# Altium schematic sheet FPGA_Board.SchDoc
size A0
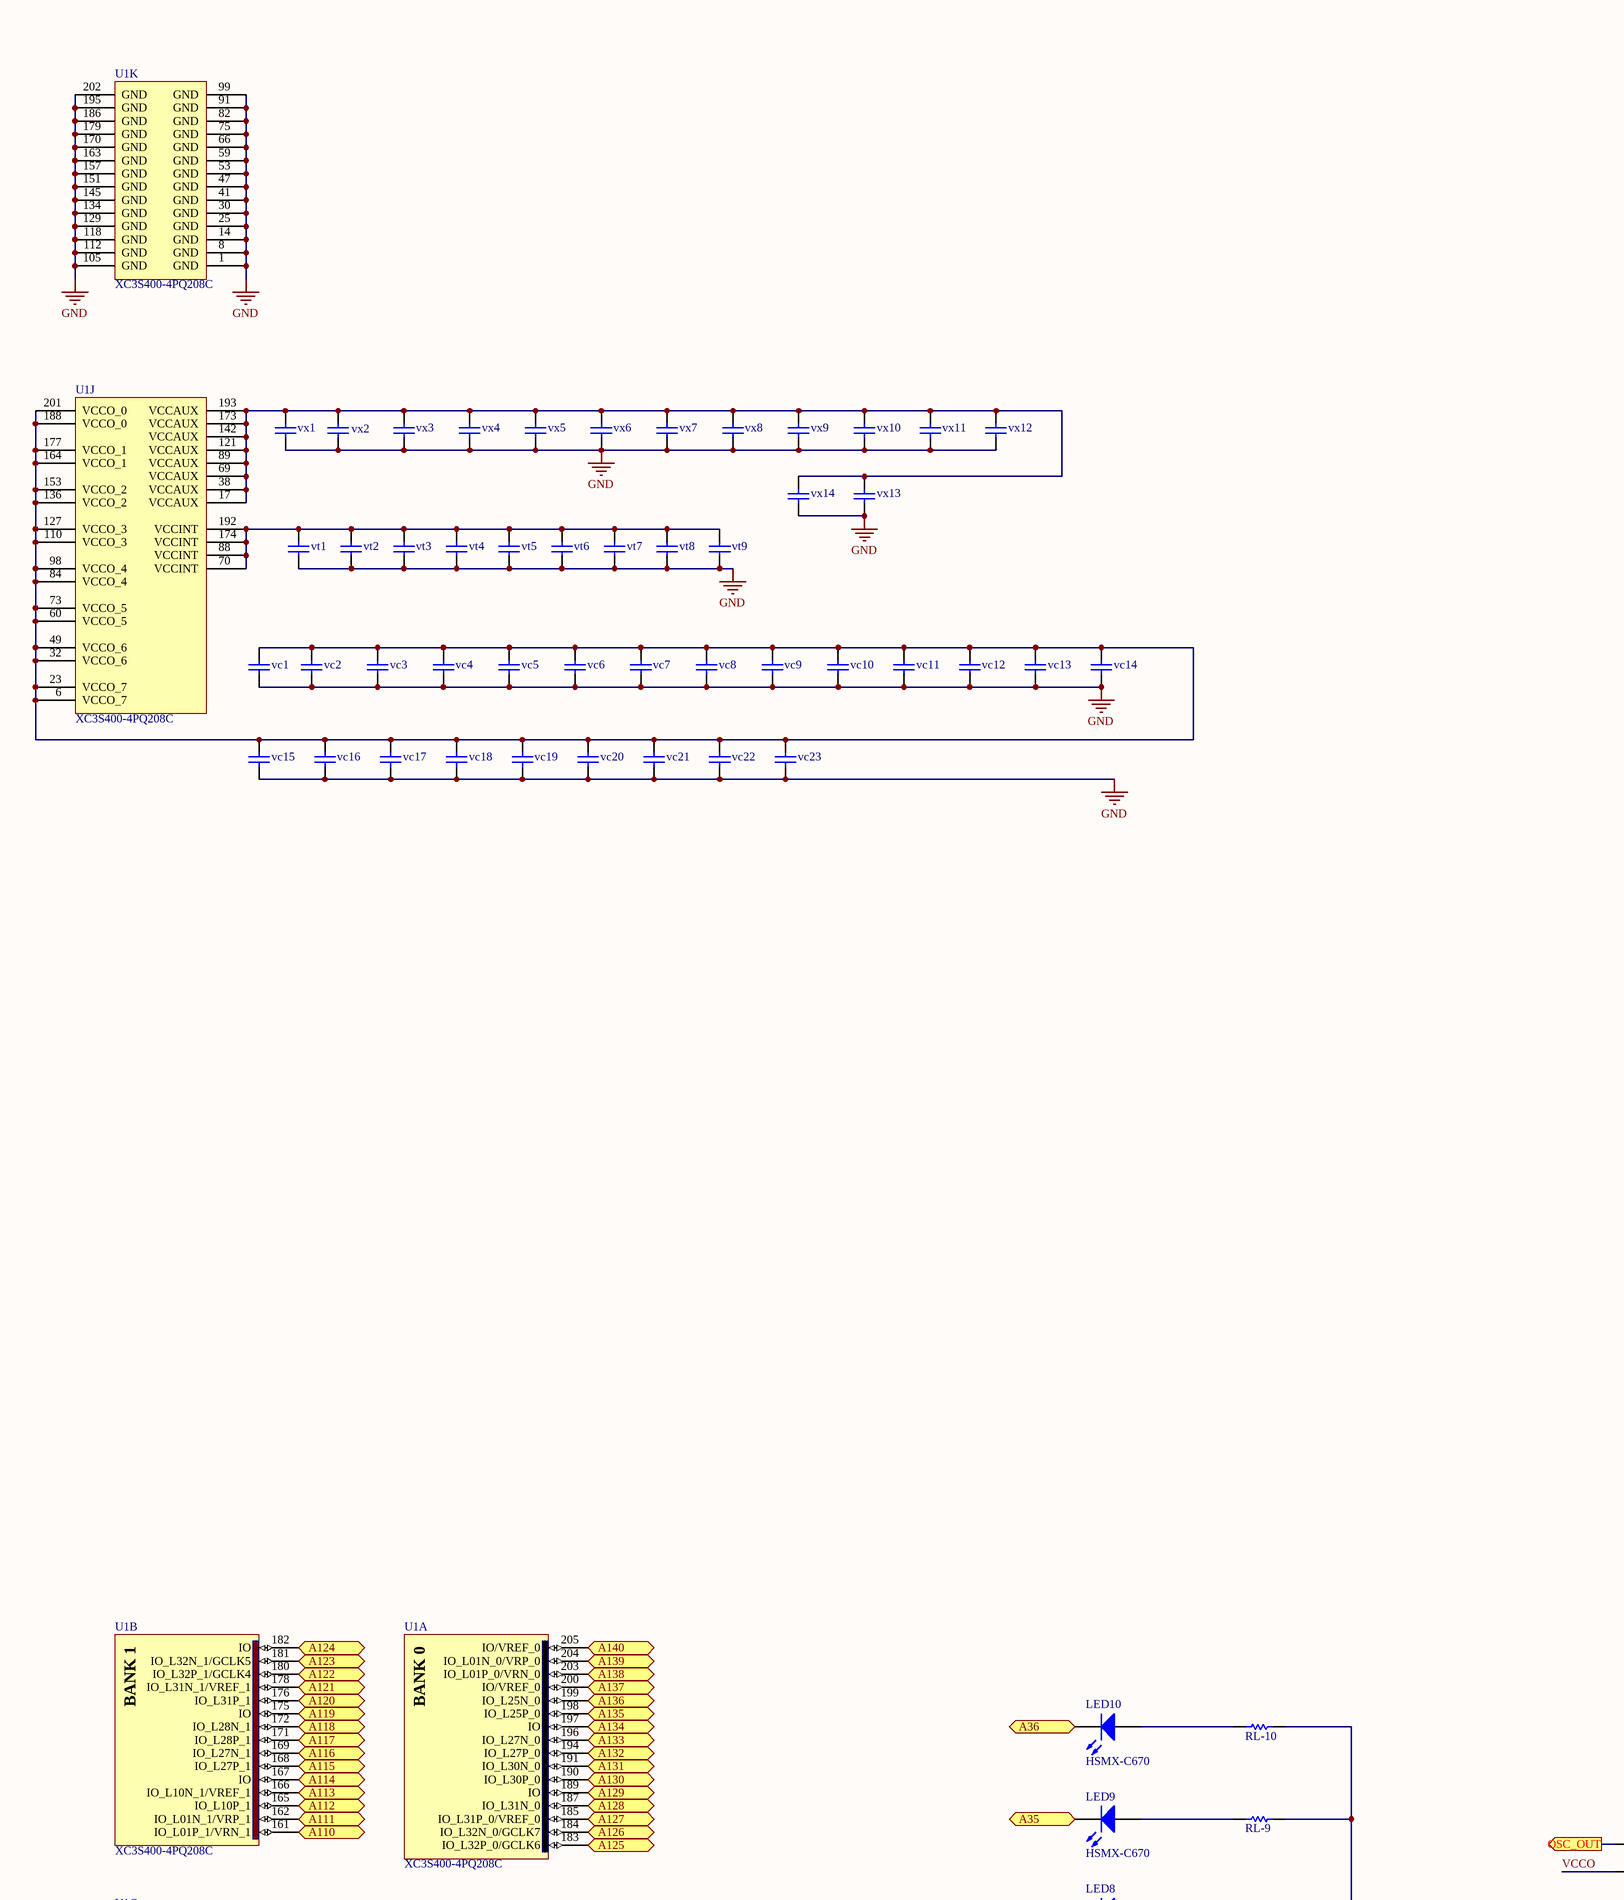
[diagram p0: FPGA_Board.SchDoc, top left]
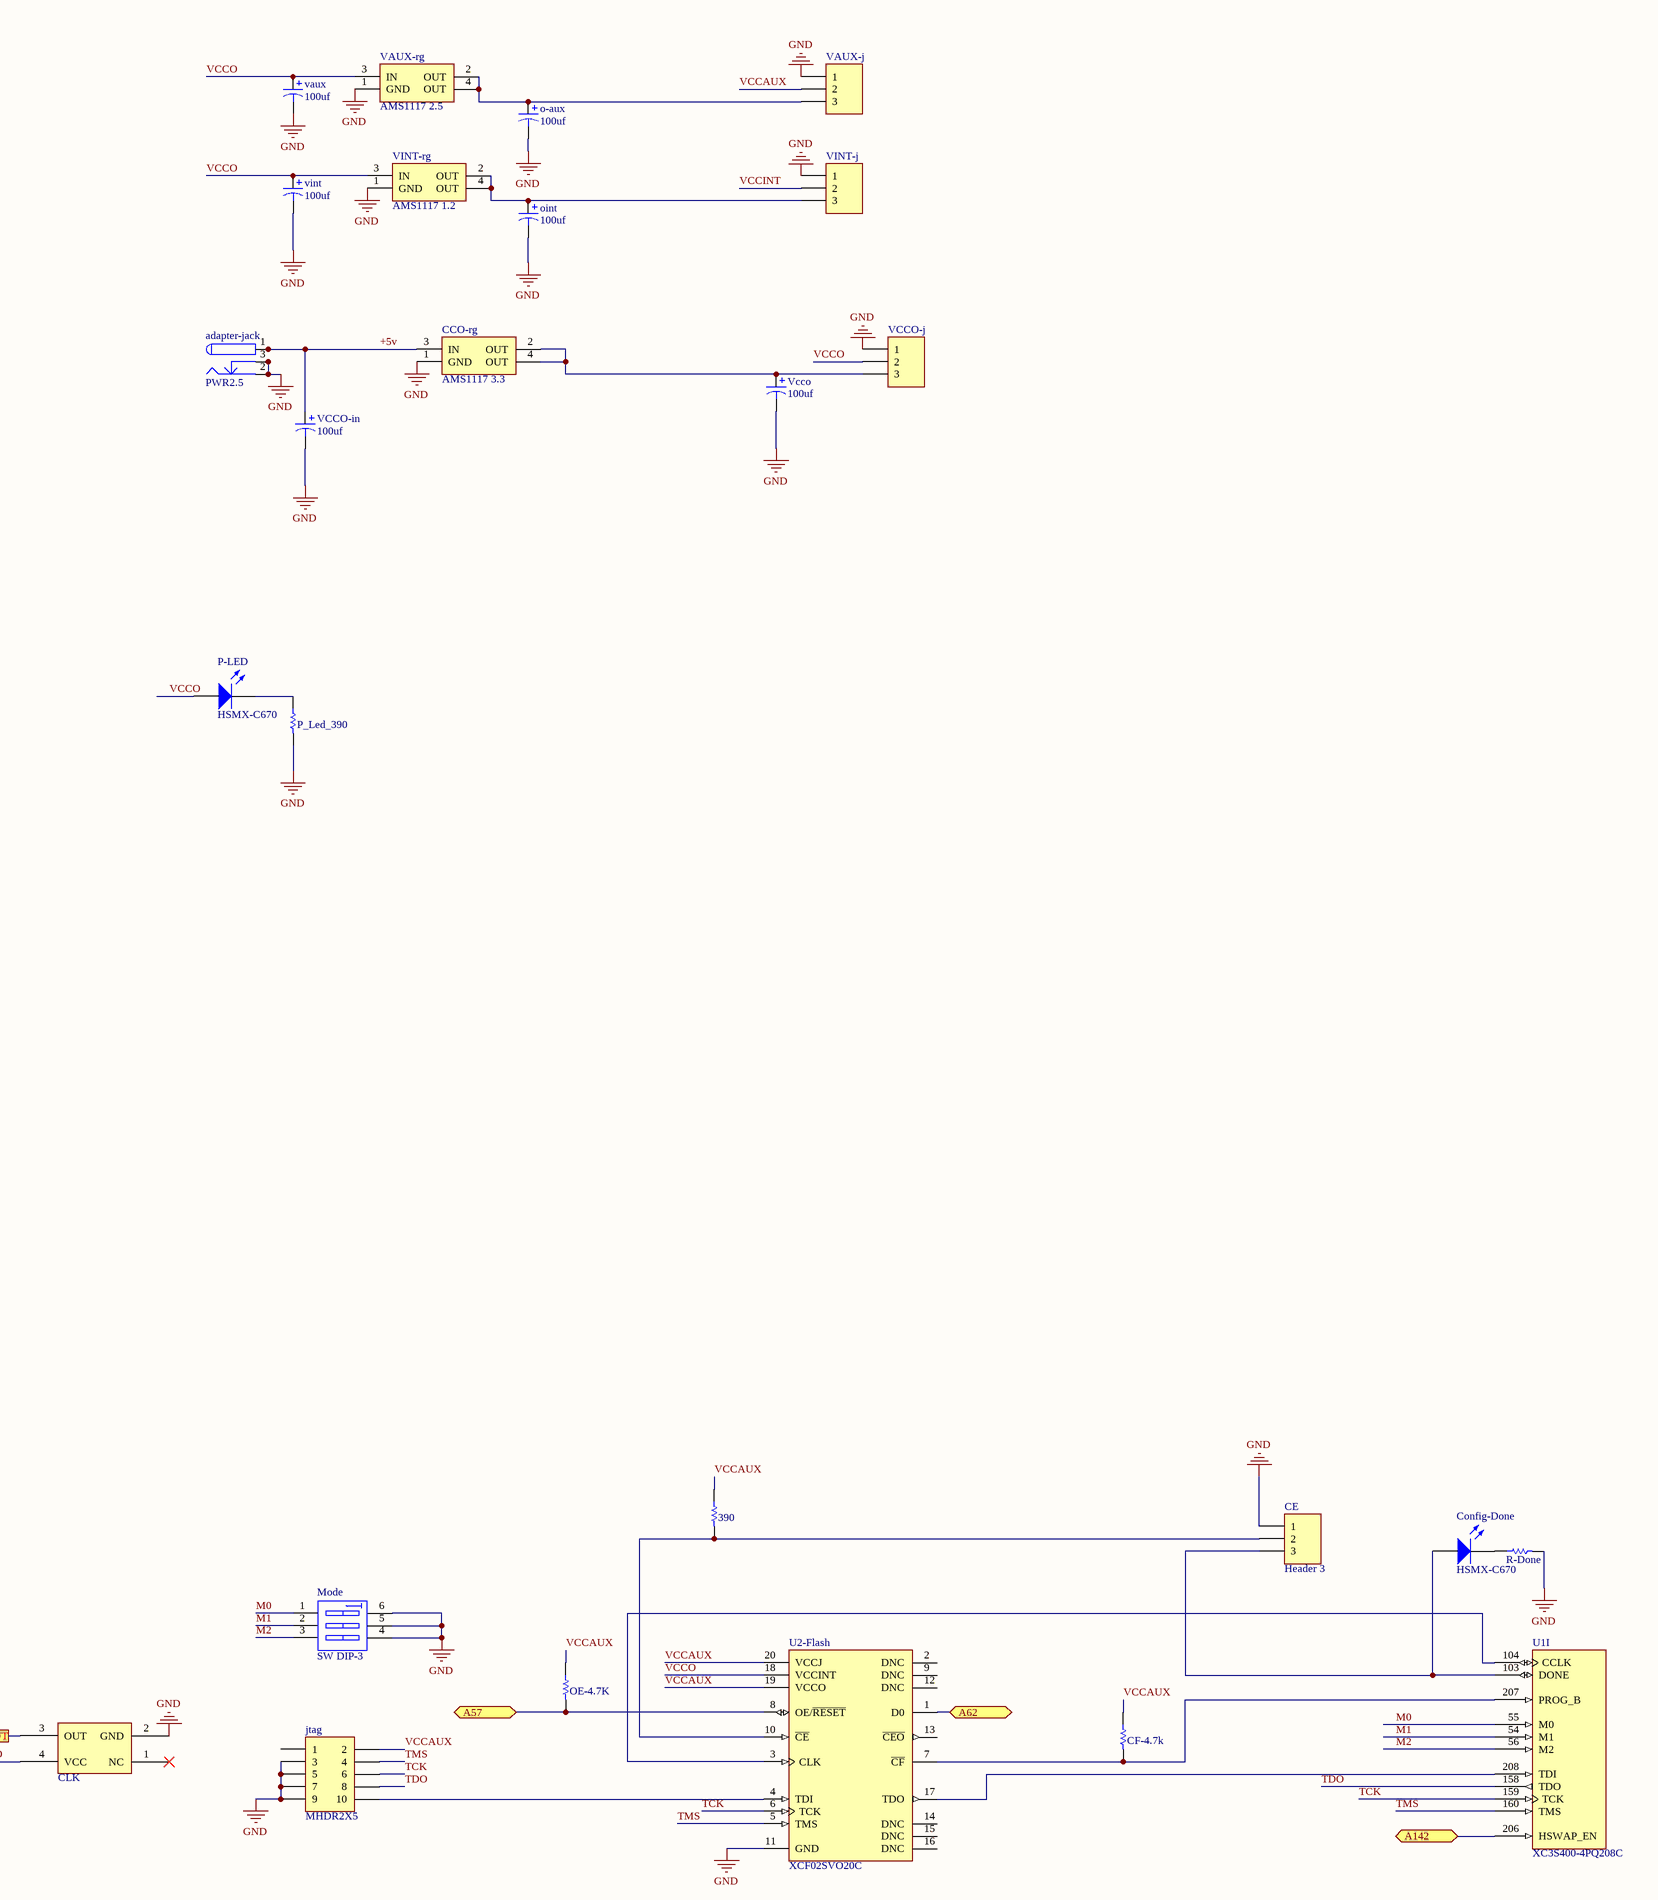
[diagram p1: FPGA_Board.SchDoc, top right]
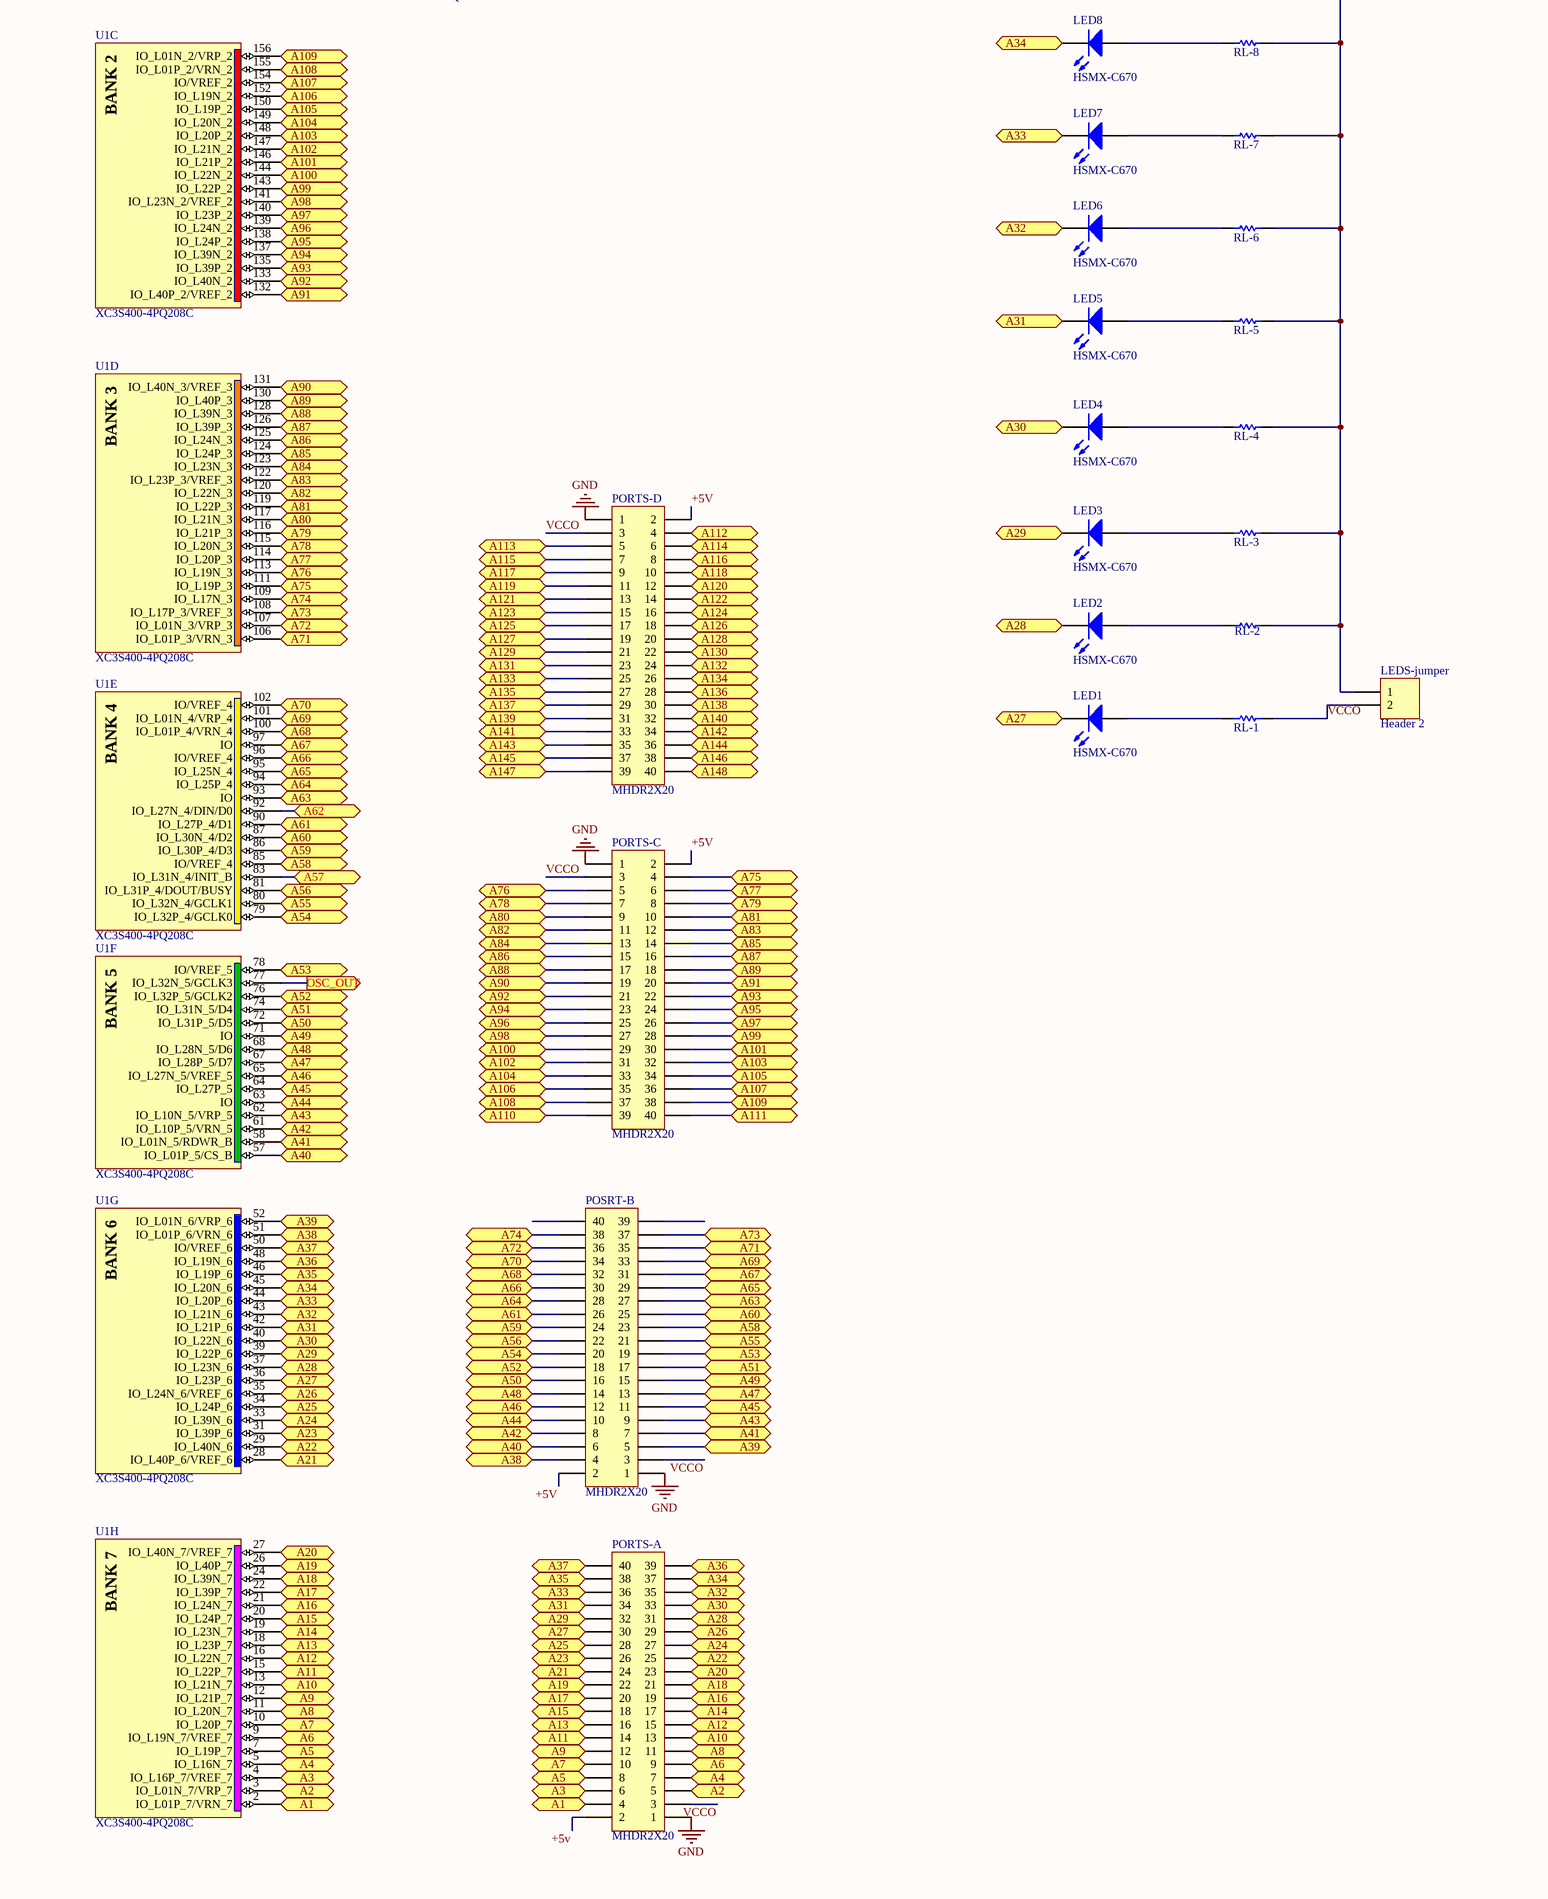
[diagram p2: FPGA_Board.SchDoc, bottom left]
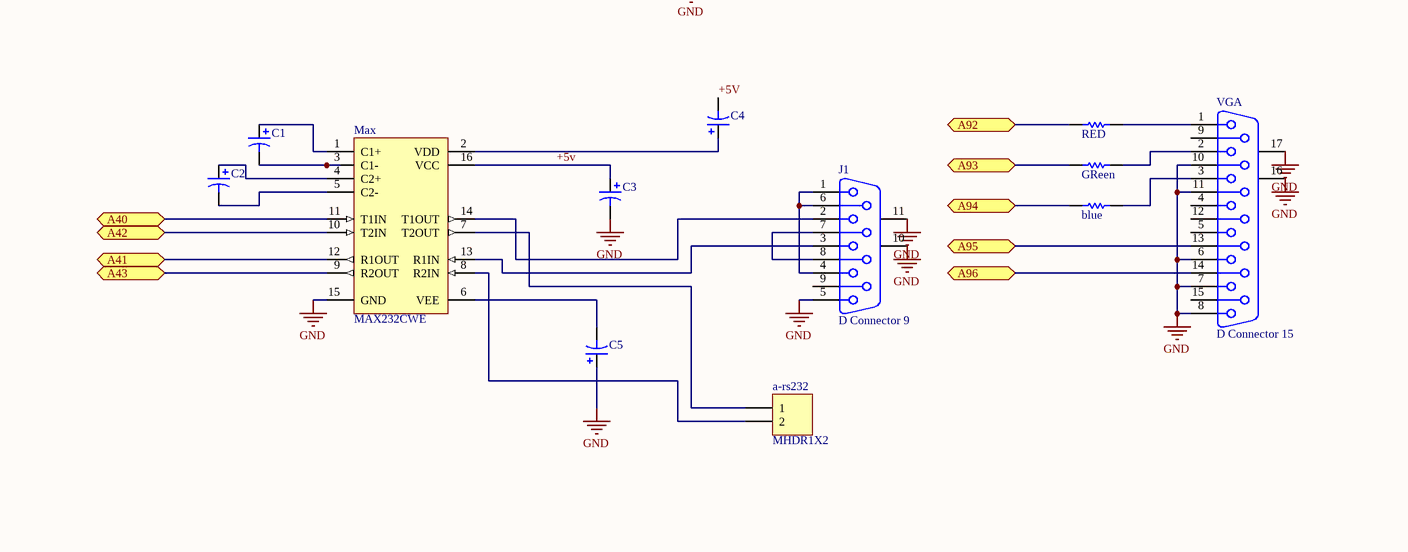
[diagram p3: FPGA_Board.SchDoc, bottom right]

## Parts
390  RES  [8-1206]  (value not drawn)
a-rs232  MHDR1X2  [HDR1X2]
adapter-jack  PWR2.5  [KLD-0202]
blue  RES  [8RB-1206]  (value not drawn)
C1  94SH105X0025ABP  [A']  (value not drawn)
C2  94SH105X0025ABP  [A']  (value not drawn)
C3  94SH105X0025ABP  [A']  (value not drawn)
C4  94SH105X0025ABP  [A']  (value not drawn)
C5  94SH105X0025ABP  [A']  (value not drawn)
CCO-rg  AMS1117 3.3  [MP04A_L]
CE  Header 3  [HDR1X3]
CF-4.7k  RES  [8-1206]  (value not drawn)
CLK  50MHZ  [50mhz]  (value not drawn)
Config-Done  HSMX-C670  [1206]
GReen  RES  [8RB-1206]  (value not drawn)
J1  D Connector 9  [DSUB1.385-2H9]
jtag  MHDR2X5  [HDR2X5]
LED1  HSMX-C670  [1206]
LED2  HSMX-C670  [1206]
LED3  HSMX-C670  [1206]
LED4  HSMX-C670  [1206]
LED5  HSMX-C670  [1206]
LED6  HSMX-C670  [1206]
LED7  HSMX-C670  [1206]
LED8  HSMX-C670  [1206]
LED9  HSMX-C670  [1206]
LED10  HSMX-C670  [1206]
LEDS-jumper  Header 2  [HDR1X2]
Max  MAX232CWE  [WSO16_N]
Mode  SW DIP-3  [DIP-6]
o-aux  100uf  [B]
OE-4.7K  RES  [8-1206]  (value not drawn)
oint  100uf  [B]
P-LED  HSMX-C670  [1206]
P_Led_390  RES  [8-1206]  (value not drawn)
PORTS-A  MHDR2X20  [HDR2X20]
PORTS-C  MHDR2X20  [HDR2X20]
PORTS-D  MHDR2X20  [HDR2X20]
POSRT-B  MHDR2X20  [HDR2X20]
R-Done  RES  [8RB-1206]  (value not drawn)
RED  RES  [8RB-1206]  (value not drawn)
RL-1  RES  [1206]  (value not drawn)
RL-2  RES  [1206]  (value not drawn)
RL-3  RES  [1206]  (value not drawn)
RL-4  RES  [1206]  (value not drawn)
RL-5  RES  [1206]  (value not drawn)
RL-6  RES  [1206]  (value not drawn)
RL-7  RES  [1206]  (value not drawn)
RL-8  RES  [1206]  (value not drawn)
RL-9  RES  [1206]  (value not drawn)
RL-10  RES  [1206]  (value not drawn)
U1  XC3S400-4PQ208C  [PQ208_N]  (parts A,B,C,D,E,F,G,H,I,J,K of 11)
U2-Flash  XCF02SVO20C  [VO20_N]
vaux  100uf  [B]
VAUX-j  (no value)  [HDR1X3]
VAUX-rg  AMS1117 2.5  [SOT223_L]
vc1  (no value)  [1206]
vc2  (no value)  [1206]
vc3  (no value)  [1206]
vc4  (no value)  [1206]
vc5  (no value)  [1206]
vc6  (no value)  [1206]
vc7  (no value)  [1206]
vc8  (no value)  [1206]
vc9  (no value)  [1206]
vc10  (no value)  [1206]
vc11  (no value)  [1206]
vc12  (no value)  [1206]
vc13  (no value)  [1206]
vc14  (no value)  [1206]
vc15  (no value)  [1206]
vc16  (no value)  [1206]
vc17  (no value)  [1206]
vc18  (no value)  [1206]
vc19  (no value)  [1206]
vc20  (no value)  [1206]
vc21  (no value)  [1206]
vc22  (no value)  [1206]
vc23  (no value)  [1206]
Vcco  100uf  [B]
VCCO-in  100uf  [B]
VCCO-j  (no value)  [HDR1X3]
VGA  D Connector 15  [DSUB1.385-2H15]
vint  100uf  [B]
VINT-j  (no value)  [HDR1X3]
VINT-rg  AMS1117 1.2  [MP04A_L]
vt1  (no value)  [1206]
vt2  (no value)  [1206]
vt3  (no value)  [1206]
vt4  (no value)  [1206]
vt5  (no value)  [1206]
vt6  (no value)  [1206]
vt7  (no value)  [1206]
vt8  (no value)  [1206]
vt9  (no value)  [1206]
vx1  (no value)  [1206]
vx2  (no value)  [1206]
vx3  (no value)  [1206]
vx4  (no value)  [1206]
vx5  (no value)  [1206]
vx6  (no value)  [1206]
vx7  (no value)  [1206]
vx8  (no value)  [1206]
vx9  (no value)  [1206]
vx10  (no value)  [1206]
vx11  (no value)  [1206]
vx12  (no value)  [1206]
vx13  (no value)  [1206]
vx14  (no value)  [1206]

## Ports
A1 (out), A2 (out), A3 (out), A4 (out), A5 (out), A6 (out), A7 (out), A8 (out), A9 (out), A10 (out), A11 (out), A12 (out), A13 (out), A14 (out), A15 (out), A16 (out), A17 (out), A18 (out), A19 (out), A20 (out), A21 (out), A22 (out), A23 (out), A24 (out), A25 (out), A26 (out), A27, A27 (out), A28, A28 (out), A29, A29 (out), A30, A30 (out), A31, A31 (out), A32, A32 (out), A33, A33 (out), A34, A34 (out), A35, A35 (out), A36, A36 (out), A37 (out), A38, A38 (out), A39, A39 (out), A40, A41, A42, A43, A44, A45, A46, A47, A48, A49, A50, A51, A52, A53, A54, A55, A56, A57, A58, A59, A60, A61, A62, A63, A64, A65, A66, A67, A68, A69, A70, A71, A72, A73, A74, A75, A76, A77, A78, A79, A80, A81, A82, A83, A84, A85, A86, A87, A88, A89, A90, A91, A92, A93, A94, A95, A96, A97, A98, A99, A100, A101, A102, A103, A104, A105, A106, A107, A108, A109, A110, A111, A112, A113, A114, A115, A116, A117, A118, A119, A120, A121, A122, A123, A124, A125, A126, A127, A128, A129, A130, A131, A132, A133, A134, A135, A136, A137, A138, A139, A140, A141, A142, A143, A144, A145, A146, A147, A148, OSC_OUT (out)

## Nets
GND: adapter-jack.2 adapter-jack.2A adapter-jack.2B adapter-jack.3 adapter-jack.3A adapter-jack.3B C3.2 C5.1 CCO-rg.1(GND) CE.1 CLK.2(GND) J1.5 J1.10(MH1) J1.11(MH2) jtag.3 jtag.5 jtag.7 jtag.9 Max.15(GND) Mode.4(B3) Mode.5(B2) Mode.6(B1) o-aux.2 oint.2 P_Led_390.2 PORTS-A.1 PORTS-C.1 PORTS-D.1 POSRT-B.1 R-Done.2 U1.1(GND) U1.8(GND) U1.14(GND) U1.25(GND) U1.30(GND) U1.41(GND) U1.47(GND) U1.53(GND) U1.59(GND) U1.66(GND) U1.75(GND) U1.82(GND) U1.91(GND) U1.99(GND) U1.105(GND) U1.112(GND) U1.118(GND) U1.129(GND) U1.134(GND) U1.145(GND) U1.151(GND) U1.157(GND) U1.163(GND) U1.170(GND) U1.179(GND) U1.186(GND) U1.195(GND) U1.202(GND) U2-Flash.11(GND) vaux.2 VAUX-j.1 VAUX-rg.1(GND) vc1.2 vc2.2 vc3.2 vc4.2 vc5.2 vc6.2 vc7.2 vc8.2 vc9.2 vc10.2 vc11.2 vc12.2 vc13.2 vc14.2 vc15.2 vc16.2 vc17.2 vc18.2 vc19.2 vc20.2 vc21.2 vc22.2 vc23.2 Vcco.2 VCCO-in.2 VCCO-j.1 VGA.6 VGA.7 VGA.8 VGA.10 VGA.11 VGA.16(MH1) VGA.17(MH2) vint.2 VINT-j.1 VINT-rg.1(GND) vt1.1 vt2.1 vt3.1 vt4.1 vt5.1 vt6.1 vt7.1 vt8.1 vt9.1 vx1.1 vx2.1 vx3.1 vx4.1 vx5.1 vx6.1 vx7.1 vx8.1 vx9.1 vx10.1 vx11.1 vx12.1 vx13.1 vx14.1
+5v: adapter-jack.1 adapter-jack.1A adapter-jack.1B C3.1 C4.2 CCO-rg.3(IN) Max.16(VCC) PORTS-A.2 PORTS-C.2 PORTS-D.2 POSRT-B.2 VCCO-in.1
A1: PORTS-A.4 U1.2(IO_L01P_7/VRN_7) ; port A1
A2: PORTS-A.5 U1.3(IO_L01N_7/VRP_7) ; port A2
A3: PORTS-A.6 U1.4(IO_L16P_7/VREF_7) ; port A3
A4: PORTS-A.7 U1.5(IO_L16N_7) ; port A4
A5: PORTS-A.8 U1.7(IO_L19P_7) ; port A5
A6: PORTS-A.9 U1.9(IO_L19N_7/VREF_7) ; port A6
A7: PORTS-A.10 U1.10(IO_L20P_7) ; port A7
A8: PORTS-A.11 U1.11(IO_L20N_7) ; port A8
A9: PORTS-A.12 U1.12(IO_L21P_7) ; port A9
A10: PORTS-A.13 U1.13(IO_L21N_7) ; port A10
A11: PORTS-A.14 U1.15(IO_L22P_7) ; port A11
A12: PORTS-A.15 U1.16(IO_L22N_7) ; port A12
A13: PORTS-A.16 U1.18(IO_L23P_7) ; port A13
A14: PORTS-A.17 U1.19(IO_L23N_7) ; port A14
A15: PORTS-A.18 U1.20(IO_L24P_7) ; port A15
A16: PORTS-A.19 U1.21(IO_L24N_7) ; port A16
A17: PORTS-A.20 U1.22(IO_L39P_7) ; port A17
A18: PORTS-A.21 U1.24(IO_L39N_7) ; port A18
A19: PORTS-A.22 U1.26(IO_L40P_7) ; port A19
A20: PORTS-A.23 U1.27(IO_L40N_7/VREF_7) ; port A20
A21: PORTS-A.24 U1.28(IO_L40P_6/VREF_6) ; port A21
A22: PORTS-A.25 U1.29(IO_L40N_6) ; port A22
A23: PORTS-A.26 U1.31(IO_L39P_6) ; port A23
A24: PORTS-A.27 U1.33(IO_L39N_6) ; port A24
A25: PORTS-A.28 U1.34(IO_L24P_6) ; port A25
A26: PORTS-A.29 U1.35(IO_L24N_6/VREF_6) ; port A26
A27: LED1.2(K) PORTS-A.30 U1.36(IO_L23P_6) ; port A27
A28: LED2.2(K) PORTS-A.31 U1.37(IO_L23N_6) ; port A28
A29: LED3.2(K) PORTS-A.32 U1.39(IO_L22P_6) ; port A29
A30: LED4.2(K) PORTS-A.33 U1.40(IO_L22N_6) ; port A30
A31: LED5.2(K) PORTS-A.34 U1.42(IO_L21P_6) ; port A31
A32: LED6.2(K) PORTS-A.35 U1.43(IO_L21N_6) ; port A32
A33: LED7.2(K) PORTS-A.36 U1.44(IO_L20P_6) ; port A33
A34: LED8.2(K) PORTS-A.37 U1.45(IO_L20N_6) ; port A34
A35: LED9.2(K) PORTS-A.38 U1.46(IO_L19P_6) ; port A35
A36: LED10.2(K) PORTS-A.39 U1.48(IO_L19N_6) ; port A36
A37: PORTS-A.40 U1.50(IO/VREF_6) ; port A37
A38: POSRT-B.4 U1.51(IO_L01P_6/VRN_6) ; port A38
A39: POSRT-B.5 U1.52(IO_L01N_6/VRP_6) ; port A39
A40: Max.11(T1IN) POSRT-B.6 U1.57(IO_L01P_5/CS_B) ; port A40
A41: Max.12(R1OUT) POSRT-B.7 U1.58(IO_L01N_5/RDWR_B) ; port A41
A42: Max.10(T2IN) POSRT-B.8 U1.61(IO_L10P_5/VRN_5) ; port A42
A43: Max.9(R2OUT) POSRT-B.9 U1.62(IO_L10N_5/VRP_5) ; port A43
A44: POSRT-B.10 U1.63(IO) ; port A44
A45: POSRT-B.11 U1.64(IO_L27P_5) ; port A45
A46: POSRT-B.12 U1.65(IO_L27N_5/VREF_5) ; port A46
A47: POSRT-B.13 U1.67(IO_L28P_5/D7) ; port A47
A48: POSRT-B.14 U1.68(IO_L28N_5/D6) ; port A48
A49: POSRT-B.15 U1.71(IO) ; port A49
A50: POSRT-B.16 U1.72(IO_L31P_5/D5) ; port A50
A51: POSRT-B.17 U1.74(IO_L31N_5/D4) ; port A51
A52: POSRT-B.18 U1.76(IO_L32P_5/GCLK2) ; port A52
A53: POSRT-B.19 U1.78(IO/VREF_5) ; port A53
A54: POSRT-B.20 U1.79(IO_L32P_4/GCLK0) ; port A54
A55: POSRT-B.21 U1.80(IO_L32N_4/GCLK1) ; port A55
A56: POSRT-B.22 U1.81(IO_L31P_4/DOUT/BUSY) ; port A56
A57: OE-4.7K.2 U1.83(IO_L31N_4/INIT_B) U2-Flash.8(OE/~{RESET}) ; port A57
A58: POSRT-B.23 U1.85(IO/VREF_4) ; port A58
A59: POSRT-B.24 U1.86(IO_L30P_4/D3) ; port A59
A60: POSRT-B.25 U1.87(IO_L30N_4/D2) ; port A60
A61: POSRT-B.26 U1.90(IO_L27P_4/D1) ; port A61
A62: U1.92(IO_L27N_4/DIN/D0) U2-Flash.1(D0) ; port A62
A63: POSRT-B.27 U1.93(IO) ; port A63
A64: POSRT-B.28 U1.94(IO_L25P_4) ; port A64
A65: POSRT-B.29 U1.95(IO_L25N_4) ; port A65
A66: POSRT-B.30 U1.96(IO/VREF_4) ; port A66
A67: POSRT-B.31 U1.97(IO) ; port A67
A68: POSRT-B.32 U1.100(IO_L01P_4/VRN_4) ; port A68
A69: POSRT-B.33 U1.101(IO_L01N_4/VRP_4) ; port A69
A70: POSRT-B.34 U1.102(IO/VREF_4) ; port A70
A71: POSRT-B.35 U1.106(IO_L01P_3/VRN_3) ; port A71
A72: POSRT-B.36 U1.107(IO_L01N_3/VRP_3) ; port A72
A73: POSRT-B.37 U1.108(IO_L17P_3/VREF_3) ; port A73
A74: POSRT-B.38 U1.109(IO_L17N_3) ; port A74
A75: PORTS-C.4 U1.111(IO_L19P_3) ; port A75
A76: PORTS-C.5 U1.113(IO_L19N_3) ; port A76
A77: PORTS-C.6 U1.114(IO_L20P_3) ; port A77
A78: PORTS-C.7 U1.115(IO_L20N_3) ; port A78
A79: PORTS-C.8 U1.116(IO_L21P_3) ; port A79
A80: PORTS-C.9 U1.117(IO_L21N_3) ; port A80
A81: PORTS-C.10 U1.119(IO_L22P_3) ; port A81
A82: PORTS-C.11 U1.120(IO_L22N_3) ; port A82
A83: PORTS-C.12 U1.122(IO_L23P_3/VREF_3) ; port A83
A84: PORTS-C.13 U1.123(IO_L23N_3) ; port A84
A85: PORTS-C.14 U1.124(IO_L24P_3) ; port A85
A86: PORTS-C.15 U1.125(IO_L24N_3) ; port A86
A87: PORTS-C.16 U1.126(IO_L39P_3) ; port A87
A88: PORTS-C.17 U1.128(IO_L39N_3) ; port A88
A89: PORTS-C.18 U1.130(IO_L40P_3) ; port A89
A90: PORTS-C.19 U1.131(IO_L40N_3/VREF_3) ; port A90
A91: PORTS-C.20 U1.132(IO_L40P_2/VREF_2) ; port A91
A92: PORTS-C.21 RED.1 U1.133(IO_L40N_2) ; port A92
A93: GReen.1 PORTS-C.22 U1.135(IO_L39P_2) ; port A93
A94: blue.1 PORTS-C.23 U1.137(IO_L39N_2) ; port A94
A95: PORTS-C.24 U1.138(IO_L24P_2) VGA.13 ; port A95
A96: PORTS-C.25 U1.139(IO_L24N_2) VGA.14 ; port A96
A97: PORTS-C.26 U1.140(IO_L23P_2) ; port A97
A98: PORTS-C.27 U1.141(IO_L23N_2/VREF_2) ; port A98
A99: PORTS-C.28 U1.143(IO_L22P_2) ; port A99
A100: PORTS-C.29 U1.144(IO_L22N_2) ; port A100
A101: PORTS-C.30 U1.146(IO_L21P_2) ; port A101
A102: PORTS-C.31 U1.147(IO_L21N_2) ; port A102
A103: PORTS-C.32 U1.148(IO_L20P_2) ; port A103
A104: PORTS-C.33 U1.149(IO_L20N_2) ; port A104
A105: PORTS-C.34 U1.150(IO_L19P_2) ; port A105
A106: PORTS-C.35 U1.152(IO_L19N_2) ; port A106
A107: PORTS-C.36 U1.154(IO/VREF_2) ; port A107
A108: PORTS-C.37 U1.155(IO_L01P_2/VRN_2) ; port A108
A109: PORTS-C.38 U1.156(IO_L01N_2/VRP_2) ; port A109
A110: PORTS-C.39 U1.161(IO_L01P_1/VRN_1) ; port A110
A111: PORTS-C.40 U1.162(IO_L01N_1/VRP_1) ; port A111
A112: PORTS-D.4 U1.165(IO_L10P_1) ; port A112
A113: PORTS-D.5 U1.166(IO_L10N_1/VREF_1) ; port A113
A114: PORTS-D.6 U1.167(IO) ; port A114
A115: PORTS-D.7 U1.168(IO_L27P_1) ; port A115
A116: PORTS-D.8 U1.169(IO_L27N_1) ; port A116
A117: PORTS-D.9 U1.171(IO_L28P_1) ; port A117
A118: PORTS-D.10 U1.172(IO_L28N_1) ; port A118
A119: PORTS-D.11 U1.175(IO) ; port A119
A120: PORTS-D.12 U1.176(IO_L31P_1) ; port A120
A121: PORTS-D.13 U1.178(IO_L31N_1/VREF_1) ; port A121
A122: PORTS-D.14 U1.180(IO_L32P_1/GCLK4) ; port A122
A123: PORTS-D.15 U1.181(IO_L32N_1/GCLK5) ; port A123
A124: PORTS-D.16 U1.182(IO) ; port A124
A125: PORTS-D.17 U1.183(IO_L32P_0/GCLK6) ; port A125
A126: PORTS-D.18 U1.184(IO_L32N_0/GCLK7) ; port A126
A127: PORTS-D.19 U1.185(IO_L31P_0/VREF_0) ; port A127
A128: PORTS-D.20 U1.187(IO_L31N_0) ; port A128
A129: PORTS-D.21 U1.189(IO) ; port A129
A130: PORTS-D.22 U1.190(IO_L30P_0) ; port A130
A131: PORTS-D.23 U1.191(IO_L30N_0) ; port A131
A132: PORTS-D.24 U1.194(IO_L27P_0) ; port A132
A133: PORTS-D.25 U1.196(IO_L27N_0) ; port A133
A134: PORTS-D.26 U1.197(IO) ; port A134
A135: PORTS-D.27 U1.198(IO_L25P_0) ; port A135
A136: PORTS-D.28 U1.199(IO_L25N_0) ; port A136
A137: PORTS-D.29 U1.200(IO/VREF_0) ; port A137
A138: PORTS-D.30 U1.203(IO_L01P_0/VRN_0) ; port A138
A139: PORTS-D.31 U1.204(IO_L01N_0/VRP_0) ; port A139
A140: PORTS-D.32 U1.205(IO/VREF_0) ; port A140
A141: PORTS-D.33 ; port A141
A142: PORTS-D.34 U1.206(HSWAP_EN) ; port A142
A143: PORTS-D.35 ; port A143
A144: PORTS-D.36 ; port A144
A145: PORTS-D.37 ; port A145
A146: PORTS-D.38 ; port A146
A147: PORTS-D.39 ; port A147
A148: PORTS-D.40 ; port A148
M0: Mode.1(A1) U1.55(M0)
M1: Mode.2(A2) U1.54(M1)
M2: Mode.3(A3) U1.56(M2)
OSC_OUT: CLK.3(OUT) U1.77(IO_L32N_5/GCLK3) ; port OSC_OUT
TCK: jtag.6 U1.159(TCK) U2-Flash.6(TCK)
TDO: jtag.8 U1.158(TDO)
TMS: jtag.4 U1.160(TMS) U2-Flash.5(TMS)
VCCAUX: 390.1 CF-4.7k.1 jtag.2 OE-4.7K.1 U2-Flash.19(VCCO) U2-Flash.20(VCCJ) VAUX-j.2
VCCINT: VINT-j.2
VCCO: CLK.4(VCC) LEDS-jumper.2 P-LED.1(A) PORTS-A.3 PORTS-C.3 PORTS-D.3 POSRT-B.3 RL-1.2 U2-Flash.18(VCCINT) vaux.1 VAUX-rg.3(IN) VCCO-j.2 vint.1 VINT-rg.3(IN)
Net390_2: 390.2 CE.2 U2-Flash.10(~{CE})
Neta-rs232_1: a-rs232.1 Max.7(T2OUT)
Neta-rs232_2: a-rs232.2 Max.8(R2IN)
Netblue_2: blue.2 VGA.3
NetC1_1: C1.1 Max.1(C1+)
NetC1_2: C1.2 Max.3(C1-)
NetC2_1: C2.1 Max.4(C2+)
NetC2_2: C2.2 Max.5(C2-)
NetC4_1: C4.1 Max.2(VDD)
NetC5_2: C5.2 Max.6(VEE)
NetCCO-rg_2: CCO-rg.2(OUT) CCO-rg.4(OUT) Vcco.1 VCCO-j.3
NetCE_3: CE.3 Config-Done.1(A) U1.103(DONE)
NetCF-4.7k_2: CF-4.7k.2 U1.207(PROG_B) U2-Flash.7(~{CF})
NetConfig-Done_2: Config-Done.2(K) R-Done.1
NetGReen_2: GReen.2 VGA.2
NetJ1_1: J1.1 J1.4 J1.6
NetJ1_2: J1.2 Max.14(T1OUT)
NetJ1_3: J1.3 Max.13(R1IN)
NetJ1_7: J1.7 J1.8
Netjtag_10: jtag.10 U2-Flash.4(TDI)
NetLED1_1: LED1.1(A) RL-1.1
NetLED2_1: LED2.1(A) RL-2.1
NetLED3_1: LED3.1(A) RL-3.1
NetLED4_1: LED4.1(A) RL-4.1
NetLED5_1: LED5.1(A) RL-5.1
NetLED6_1: LED6.1(A) RL-6.1
NetLED7_1: LED7.1(A) RL-7.1
NetLED8_1: LED8.1(A) RL-8.1
NetLED9_1: LED9.1(A) RL-9.1
NetLED10_1: LED10.1(A) RL-10.1
NetLEDS-jumper_1: LEDS-jumper.1 RL-2.2 RL-3.2 RL-4.2 RL-5.2 RL-6.2 RL-7.2 RL-8.2 RL-9.2 RL-10.2
Neto-aux_1: o-aux.1 VAUX-j.3 VAUX-rg.2(OUT) VAUX-rg.4(OUT)
Netoint_1: oint.1 VINT-j.3 VINT-rg.2(OUT) VINT-rg.4(OUT)
NetP-LED_2: P-LED.2(K) P_Led_390.1
NetRED_2: RED.2 VGA.1
NetU1_6: U1.6(VCCO_7) U1.23(VCCO_7) U1.32(VCCO_6) U1.49(VCCO_6) U1.60(VCCO_5) U1.73(VCCO_5) U1.84(VCCO_4) U1.98(VCCO_4) U1.110(VCCO_3) U1.127(VCCO_3) U1.136(VCCO_2) U1.153(VCCO_2) U1.164(VCCO_1) U1.177(VCCO_1) U1.188(VCCO_0) U1.201(VCCO_0) vc1.1 vc2.1 vc3.1 vc4.1 vc5.1 vc6.1 vc7.1 vc8.1 vc9.1 vc10.1 vc11.1 vc12.1 vc13.1 vc14.1 vc15.1 vc16.1 vc17.1 vc18.1 vc19.1 vc20.1 vc21.1 vc22.1 vc23.1
NetU1_17: U1.17(VCCAUX) U1.38(VCCAUX) U1.69(VCCAUX) U1.89(VCCAUX) U1.121(VCCAUX) U1.142(VCCAUX) U1.173(VCCAUX) U1.193(VCCAUX) vx1.2 vx2.2 vx3.2 vx4.2 vx5.2 vx6.2 vx7.2 vx8.2 vx9.2 vx10.2 vx11.2 vx12.2 vx13.2 vx14.2
NetU1_70: U1.70(VCCINT) U1.88(VCCINT) U1.174(VCCINT) U1.192(VCCINT) vt1.2 vt2.2 vt3.2 vt4.2 vt5.2 vt6.2 vt7.2 vt8.2 vt9.2
NetU1_104: U1.104(CCLK) U2-Flash.3(CLK)
NetU1_208: U1.208(TDI) U2-Flash.17(TDO)

Not connected (* = marked no-connect by the designer): CLK 1(NC)*; J1 9; jtag 1; POSRT-B 39 40; U2-Flash 2(DNC) 9(DNC) 12(DNC) 13(~{CEO}) 14(DNC) 15(DNC) 16(DNC); VGA 4 5 9 12 15

## Notes on the sheet
- Title
- Size:
- Date:
- File:
- A0
- Number:
- Time:
- Revision:
- Sheet
- of
- (in symbol XC3S400-4PQ208C, part A) BANK 0
- (in symbol XC3S400-4PQ208C, part B) BANK 1
- (in symbol XC3S400-4PQ208C, part C) BANK 2
- (in symbol XC3S400-4PQ208C, part D) BANK 3
- (in symbol XC3S400-4PQ208C, part E) BANK 4
- (in symbol XC3S400-4PQ208C, part F) BANK 5
- (in symbol XC3S400-4PQ208C, part G) BANK 6
- (in symbol XC3S400-4PQ208C, part H) BANK 7

## Library data of the parts
390 blue CF-4.7k GReen OE-4.7K P_Led_390 R-Done RED RL-1-RL-10 = RES: Resistor; Published: 5-Jan-2004; DatasheetDocument: Nov-2002; Publisher: Altium Limited
a-rs232 = MHDR1X2: Header, 2-Pin; LatestRevisionDate: 17-Jul-2002; LatestRevisionNote: Re-released for DXP Platform.; Publisher: Altium Limited
adapter-jack = PWR2.5: Low Voltage Power Supply Connector; Published: 17-Dec-2003; DatasheetDocument: 09-May-2002; Publisher: Altium Limited; ComponentLink1Description: Manufacturer Link; ComponentLink1URL: http://domino.kycon.com/internet/Products.html
C1-C5 = 94SH105X0025ABP: Solid Aluminum Capacitor with Organic Semiconductor Electrolyte: 1uF, 25V, Bulk Pack; Note: Part Numbers shown are for ± 20% capacitance tolerance (X0).; PCB_Layout: Complies with Manufacturer's Recommendation.; DrillSize: Nominal, Rounded to the nearest 0.1mm; Published: 19-Mar-2004; DatasheetDocument: 23-May-2001; PackageReference: A; Publisher: Altium Limited; ComponentLink1Description: Manufacturer Link; ComponentLink1URL: http://www.vishay.com/; ComponentLink2Description: Datasheet; ComponentLink2URL: http://www.vishay.com/docs/90006/94sh.pdf; Value: 1uF
CCO-rg VAUX-rg VINT-rg = REG1117-3.3: 800mA and 1A Low Dropout Positive Regulator 2.85V, 3.3V, 5V, and Adjustable; Published: 8-Jun-2000; LatestRevisionDate: 17-Jul-2002; LatestRevisionNote: Re-released for DXP Platform.; DatasheetVersion: Sep-1997; PackageVersion: revC; PackageReference: ZZ311; Publisher: Altium Limited; PackageDescription: SOT-223/SC-73; 4 Leads; Body 6.7 x 7.3 mm, inc. leads (LxW max); ComponentLink1Description: Manufacturer Link; ComponentLink1URL: http://www.ti.com/; ComponentLink2Description: Datasheet; ComponentLink2URL: http://www-s.ti.com/sc/ds/REG1117.pdf
CE VAUX-j VCCO-j VINT-j = Header 3: Header, 3-Pin; LatestRevisionDate: 17-Jul-2002; LatestRevisionNote: Re-released for DXP Platform.; Publisher: Altium Limited
Config-Done LED1-LED10 P-LED = HSMX-C670: RED AS AlGaAs SMD LED; Published: 5-Jan-2004; DatasheetDocument: 30-Apr-2002; Publisher: Altium Limited
J1 = D Connector 9: Receptacle Assembly, 9 Position, Right Angle; PackageDocument: O; Positions: 9; Published: 15-Jun-2001; LatestRevisionDate: 17-Jul-2002; LatestRevisionNote: Re-released for DXP Platform.; DatasheetDocument: 1-Sep-1999; PackageReference: 788750; Publisher: Altium Limited; Orientation: Right Angle; Gender: Receptacle
jtag = MHDR2X5: Header, 5-Pin, Dual row; LatestRevisionDate: 17-Jul-2002; LatestRevisionNote: Re-released for DXP Platform.; Publisher: Altium Limited
LEDS-jumper = Header 2: Header, 2-Pin; LatestRevisionDate: 17-Jul-2002; LatestRevisionNote: Re-released for DXP Platform.; Publisher: Altium Limited
Max = MAX232CWE: +5V Powered RS-232 Driver/Receiver; Published: 16-Jan-2001; LatestRevisionDate: 13-Apr-2006; LatestRevisionNote: IPC-7351 Footprint Added.; DatasheetVersion: Apr-1992; PackageReference: WSO16; Publisher: Altium Limited; PackageDescription: 16-Pin Small Outline Integrated Circuit 1.27 mm Pitch; Code_JEDEC: MS-013-AA; Code_IPC: SOIC127P1030-16; ComponentLink1Description: Manufacturer Link; ComponentLink1URL: http://www.maxim-ic.com/; ComponentLink2Description: Datasheet; ComponentLink2URL: http://pdfserv.maxim-ic.com/en/ds/MAX220-MAX249.pdf
Mode = SW DIP-3: DIP Switch, 3 Position, SPST; Published: 24-Mar-1999; LatestRevisionDate: 17-Jul-2002; LatestRevisionNote: Re-released for DXP Platform.; PackageReference: DIP-6; Publisher: Altium Limited; Code_JEDEC: MO-001-AM
o-aux oint vaux Vcco vint = 94SA107X0016EBP: Solid Aluminum Capacitor with Organic Semiconductor Electrolyte: 100uF, 16V, Bulk Pack; Note: Part Numbers shown are for ± 20% capacitance tolerance (X0).; PCB_Layout: Complies with Manufacturer's Recommendation.; DrillSize: Nominal, Rounded to the nearest 0.1mm; Published: 19-Mar-2004; DatasheetDocument: 29-Jun-2001; PackageReference: E; Publisher: Altium Limited; ComponentLink1Description: Manufacturer Link; ComponentLink1URL: http://www.vishay.com/; ComponentLink2Description: Datasheet; ComponentLink2URL: http://www.vishay.com/docs/90003/94sa.pdf; Value: 100uF
PORTS-A PORTS-C PORTS-D POSRT-B = MHDR2X20: Header, 20-Pin, Dual row; LatestRevisionDate: 17-Jul-2002; LatestRevisionNote: Re-released for DXP Platform.; Publisher: Altium Limited
U1 = XC3S400-4PQ208C: Spartan-3 1.2V FPGA, 141 User I/Os, 208-Pin PQFP, Standard Performance, Commercial Grade; OrderingInformation: Additional code may have to be appended for different mask revision devices.; Published: 17-Sep-2003; LatestRevisionDate: 01-Mar-2010; LatestRevisionNote: Updated to datasheet version 2.5 Dec-2009.; DatasheetVersion: ver2.5, Dec-2009; PackageVersion: ver1.2, Jun-2004; PackageReference: PQ208; Publisher: Altium Limited; PackageDescription: 208-Pin Plastic Quad Flat Pack (PQ208); Supplier 1: Digi-Key; Supplier Part Number 1: XC3S400-4PQ208C-ND; Code_JEDEC: MS-029-FA-1; ComponentLink1Description: Spartan-3 Datasheet; ComponentLink1URL: http://www.xilinx.com/support/documentation/data_sheets/ds099.pdf; ComponentLink2Description: PQ208 Package Drawing; ComponentLink2URL: http://www.xilinx.com/support/documentation/package_specs/pq208.pdf; ComponentLink3Description: Spartan-3 Documents; ComponentLink3URL: http://www.xilinx.com/support/documentation/spartan-3.htm; ComponentLink4Description: Xilinx.com Home; ComponentLink4URL: http://www.xilinx.com
U2-Flash = XCF02SVO20C: XCF00S Series, Platform Flash In-System Programmable Configuration 3.3V PROM, 20-Pin TSOP, 2-Megabit, Commercial Grade; Published: 17-Sep-2003; LatestRevisionDate: 16-Nov-2009; LatestRevisionNote: Updated to datasheet version 2.17, Oct-2009.; DatasheetVersion: ver2.17, Oct-2009; PackageVersion: ver1.3, Dec-2008; PackageReference: VO20; Publisher: Altium Limited; PackageDescription: 20-Pin Thin Shrink Small Outline Package (VO20); Supplier 1: Digi-Key; Supplier Part Number 1: XCF02SVO20C-ND; Code_JEDEC: MO-153-AC; ComponentLink1Description: Platform Flash Datasheet; ComponentLink1URL: http://www.xilinx.com/support/documentation/data_sheets/ds123.pdf; ComponentLink2Description: VO20 Package Drawing; ComponentLink2URL: http://www.xilinx.com/support/documentation/package_specs/vo20.pdf; ComponentLink3Description: Configuration PROM Documents; ComponentLink3URL: http://www.xilinx.com/support/documentation/configuration_proms.htm; ComponentLink4Description: Xilinx.com Home; ComponentLink4URL: http://www.xilinx.com
vc1-vc23 vt1-vt9 vx1-vx14 = C1206: Ceramic Chip Capacitor - Standard; Published: 17-Jul-2002; LatestRevisionDate: 19-Mar-2004; LatestRevisionNote: Silkscreen size reduced.; DatasheetDocument: Mar-2001; PackageDocument: Mar-2001; PackageReference: 1206; Publisher: Altium Limited; Code_JEITA: 1206; Code_IPC: 3216 [1206]; ComponentLink1Description: Manufacturer Link; ComponentLink1URL: http://www.kemet.com/; ComponentLink2Description: Datasheet; ComponentLink2URL: http://www.kemet.com/kemet/web/homepage/kechome.nsf/vapubfilesname/F3102TA.pdf/$file/F3102TA.pdf
VCCO-in = TC10-6C3RM: Subminiature, Leaded Solid Tantalum Capacitor: Radial-Lead, Polarised, 10uF, 20% Tolerance, 6 WVDC @ +85°C; Note: See Data Sheet for full range of components; Published: 19-Mar-2004; DatasheetDocument: 13-Jun-2002; PackageReference: C3; Publisher: Altium Limited; ComponentLink1Description: Manufacturer Link; ComponentLink1URL: http://www.vishay.com/; ComponentLink2Description: Datasheet; ComponentLink2URL: http://www.vishay.com/docs/43005/tc.pdf; Value: 10uF
VGA = D Connector 15: Receptacle Assembly, 15 Position, Right Angle; PackageDocument: O; Positions: 15; Published: 15-Jun-2001; LatestRevisionDate: 17-Jul-2002; LatestRevisionNote: Re-released for DXP Platform.; DatasheetDocument: 1-Sep-99; PackageReference: 788757; Publisher: Altium Limited; Orientation: Right Angle; Gender: Receptacle